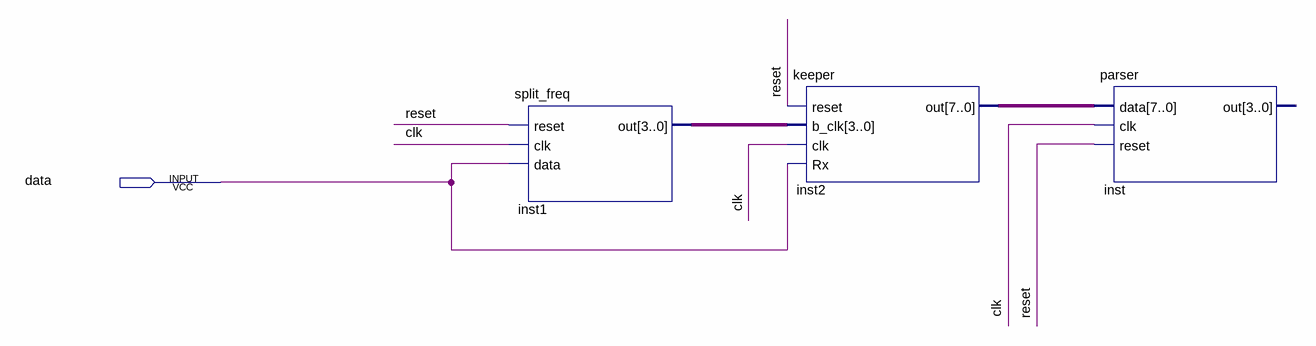
[diagram p0: schematic sheet]
// Quartus schematic block.bdf as structural Verilog: 3 symbols, 1 pins
module block (
  input  data
);

  wire clk, reset;
  wire [3:0] inst1_out;
  wire [7:0] inst2_out;

  split_freq inst1 (.reset(reset), .clk(clk), .data(data), .out(inst1_out));
  keeper inst2 (.reset(reset), .b_clk(inst1_out), .clk(clk), .Rx(data), .out(inst2_out));
  parser inst (.data(inst2_out), .clk(clk), .reset(reset));  // open: out
endmodule
